# EAGLE design aw_301_runner (EAGLE 6.4)
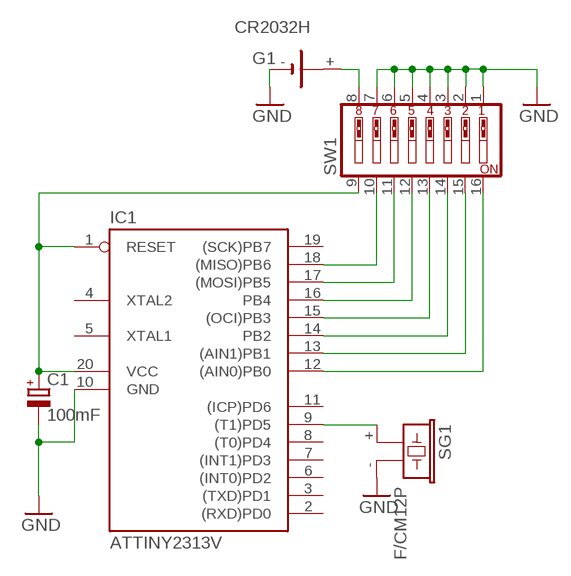
[diagram p0: schematic, sheet 1]

## Parts
C1  100mF  CPOL-EUE2.5-6  [E2,5-6]
G1  CR2032H  [CR2032H]
IC1  ATTINY2313V  AT90S2313P  [DIL20]
SG1  F/CM12P  [F/CM12P]
SW1  SW_DIP-8  [EDG-08]

## Nets
GND: C1.- G1.- IC1.10(GND) SG1.- SW1.1 SW1.2 SW1.3 SW1.4 SW1.5 SW1.6 SW1.7
N$1: IC1.9((T1)PD5) SG1.+
N$4: IC1.12((AIN0)PB0) SW1.16
N$5: C1.+ IC1.1(RESET) IC1.20(VCC) SW1.9
N$7: IC1.13((AIN1)PB1) SW1.15
N$8: IC1.14(PB2) SW1.14
N$9: IC1.15((OCI)PB3) SW1.13
N$10: IC1.16(PB4) SW1.12
N$11: IC1.17((MOSI)PB5) SW1.11
N$12: IC1.18((MISO)PB6) SW1.10
VCC: G1.+ SW1.8
Unconnected: G1.+@1(+) IC1.2((RXD)PD0) IC1.3((TXD)PD1) IC1.4(XTAL2) IC1.5(XTAL1) IC1.6((INT0)PD2) IC1.7((INT1)PD3) IC1.8((T0)PD4) IC1.11((ICP)PD6) IC1.19((SCK)PB7)

## Library data of the parts
C1 = resistor:CPOL-EU: POLARIZED CAPACITOR, European symbol
G1 = battery:CR2032H: LI BATTERY Varta
IC1 = atmel:AT90S2313: MICROCONTROLLER 2 Kbytes FLASH 128 bytes SRAM 128 bytes EEPROM UART; OC_FARNELL: unknown; OC_NEWARK: unknown
SG1 = buzzer:F/CM12P: BUZZER Source: Buerklin; OC_FARNELL: unknown; OC_NEWARK: unknown
SW1 = special:SW_DIP-8: DIP SWITCH

## Net classes
0 default: width 1.27 mm, clearance 0.762 mm

## Board
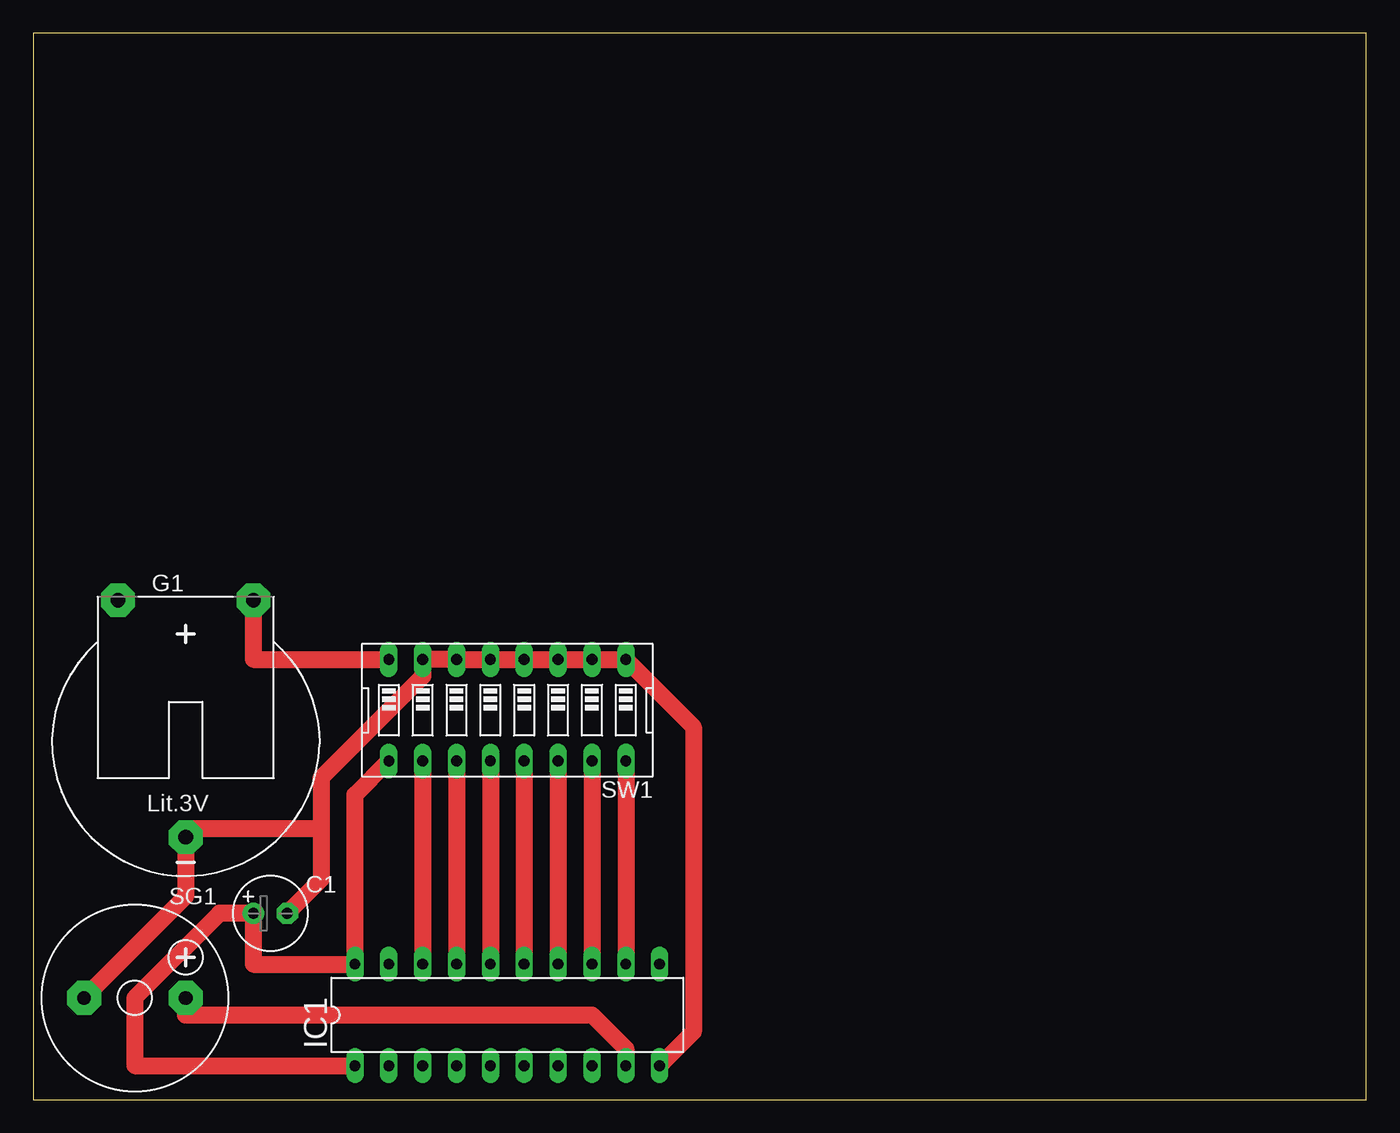
[diagram p1: board, top side]

Size 100 x 80 mm. Coordinates in mm from the lower left corner, seen from the top.
Outline: 0,0 100,0 100,80 0,80 0,0
Copper layers (1*16): Top 0.035mm / dielectric 1.5mm / Bottom 0.035mm
Design rules "default": minimum track width 10mil, minimum drill 24mil, track to track 8mil, track to pad 8mil, pad to pad 8mil, via to via 8mil, smd to smd 8mil, copper to edge 40mil, drill to drill 8mil, minimum pad ring 10mil, minimum via ring 8mil, stop-mask expansion 4mil, vias tented up to drill 0mil, thermal gap 10mil

### Footprints (pad centres in the part's own frame; a part is rotated, then mirrored left to right if it is on the bottom)
E2,5-6 = drill 0.813 pad 1.6: + -1.27,0 | drill 0.813 pad 1.6 octagon: - 1.27,0
CR2032H = drill 1.118 pad 2.54 octagon: + 5.08,10.795; +@1 -5.08,10.795; - 0,-6.985
DIL20 = drill 0.813 long: 1 -11.43,-3.81; 2 -8.89,-3.81; 3 -6.35,-3.81; 4 -3.81,-3.81; 5 -1.27,-3.81; 6 1.27,-3.81; 7 3.81,-3.81; 8 6.35,-3.81; 9 8.89,-3.81; 10 11.43,-3.81; 11 11.43,3.81; 12 8.89,3.81; 13 6.35,3.81; 14 3.81,3.81; 15 1.27,3.81; 16 -1.27,3.81; 17 -3.81,3.81; 18 -6.35,3.81; 19 -8.89,3.81; 20 -11.43,3.81
F/CM12P = drill 1.016 pad 2.54 octagon: + 3.81,0; - -3.81,0
EDG-08 = drill 0.813 long: 1 -8.89,-3.81; 2 -6.35,-3.81; 3 -3.81,-3.81; 4 -1.27,-3.81; 5 1.27,-3.81; 6 3.81,-3.81; 7 6.35,-3.81; 8 8.89,-3.81; 9 8.89,3.81; 10 6.35,3.81; 11 3.81,3.81; 12 1.27,3.81; 13 -1.27,3.81; 14 -3.81,3.81; 15 -6.35,3.81; 16 -8.89,3.81

### Placement (x,y rotation side)
C1  17.78,13.97 0 top
G1  11.43,26.67 0 top
IC1  35.56,6.35 0 top
SG1  7.62,7.62 0 top
SW1  35.56,29.21 180 top

### Tracks (layer width: path | path; a pad name or v marks a point on that pad's centre or on a via)
GND
  Top 1.27: SG1.- 11.43,15.24 G1.- 11.43,20.32 21.59,20.32 | IC1.10 49.53,5.08 49.53,27.94 SW1.1 SW1.2 SW1.3 SW1.4 SW1.5 SW1.6 SW1.7 29.21,31.75 21.59,24.13 21.59,20.32 | C1.- 21.59,16.51 21.59,20.32
N$1
  Top 1.27: IC1.9 44.45,3.81 41.91,6.35 11.43,6.35 SG1.+
N$4
  Top 1.27: SW1.16 IC1.12
N$5
  Top 1.27: IC1.1 7.62,2.54 7.62,7.62 13.97,13.97 C1.+ 16.51,10.16 IC1.20 24.13,22.86 SW1.9
N$7
  Top 1.27: SW1.15 IC1.13
N$8
  Top 1.27: SW1.14 IC1.14
N$9
  Top 1.27: SW1.13 IC1.15
N$10
  Top 1.27: SW1.12 IC1.16
N$11
  Top 1.27: SW1.11 IC1.17
N$12
  Top 1.27: SW1.10 IC1.18
VCC
  Top 1.27: SW1.8 16.51,33.02 G1.+